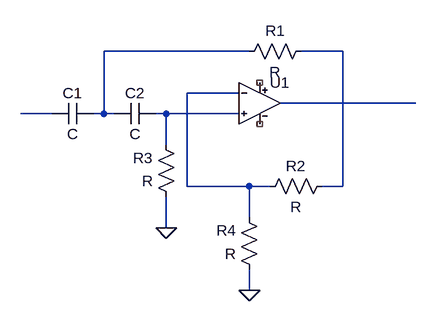
[diagram p0: schematic high pass.asc]
high pass.asc, the LTspice schematic file:
Version 4
SHEET 1 880 680
WIRE 304 0 80 0
WIRE 448 0 384 0
WIRE 288 64 208 64
WIRE 560 80 352 80
WIRE 0 96 -48 96
WIRE 80 96 80 0
WIRE 80 96 64 96
WIRE 96 96 80 96
WIRE 176 96 160 96
WIRE 288 96 176 96
WIRE 176 144 176 96
WIRE 208 208 208 64
WIRE 304 208 208 208
WIRE 336 208 304 208
WIRE 448 208 448 0
WIRE 448 208 416 208
WIRE 304 256 304 208
WIRE 176 272 176 224
WIRE 304 368 304 336
FLAG 176 272 0
FLAG 304 368 0
SYMBOL cap 64 80 R90
WINDOW 0 0 32 VBottom 2
WINDOW 3 32 32 VTop 2
SYMATTR InstName C1
SYMBOL cap 160 80 R90
WINDOW 0 0 32 VBottom 2
WINDOW 3 32 32 VTop 2
SYMATTR InstName C2
SYMBOL res 400 -16 R90
WINDOW 0 0 56 VBottom 2
WINDOW 3 32 56 VTop 2
SYMATTR InstName R1
SYMBOL res 432 192 R90
WINDOW 0 0 56 VBottom 2
WINDOW 3 32 56 VTop 2
SYMATTR InstName R2
SYMBOL res 192 240 R180
WINDOW 0 36 76 Left 2
WINDOW 3 36 40 Left 2
SYMATTR InstName R3
SYMBOL res 320 352 R180
WINDOW 0 36 76 Left 2
WINDOW 3 36 40 Left 2
SYMATTR InstName R4
SYMBOL TL074 320 80 R0
SYMATTR InstName U1

The netlist it stands for:
* high pass.asc
C1 N001 N005 C
C2 N006 N001 C
R1 N002 N001 R
R2 N002 N003 R
R3 0 N006 R
R4 0 N003 R
XU1 N006 N003 NC_01 NC_02 N004 TL074  ; pins In+ In- V+ V- OUT
.lib C:\Users\thusa.THUSA\Downloads\sloj068\TL074.301
.backanno
.end